# EAGLE design InexpensiveTNC-v4-mod (EAGLE 6.3)
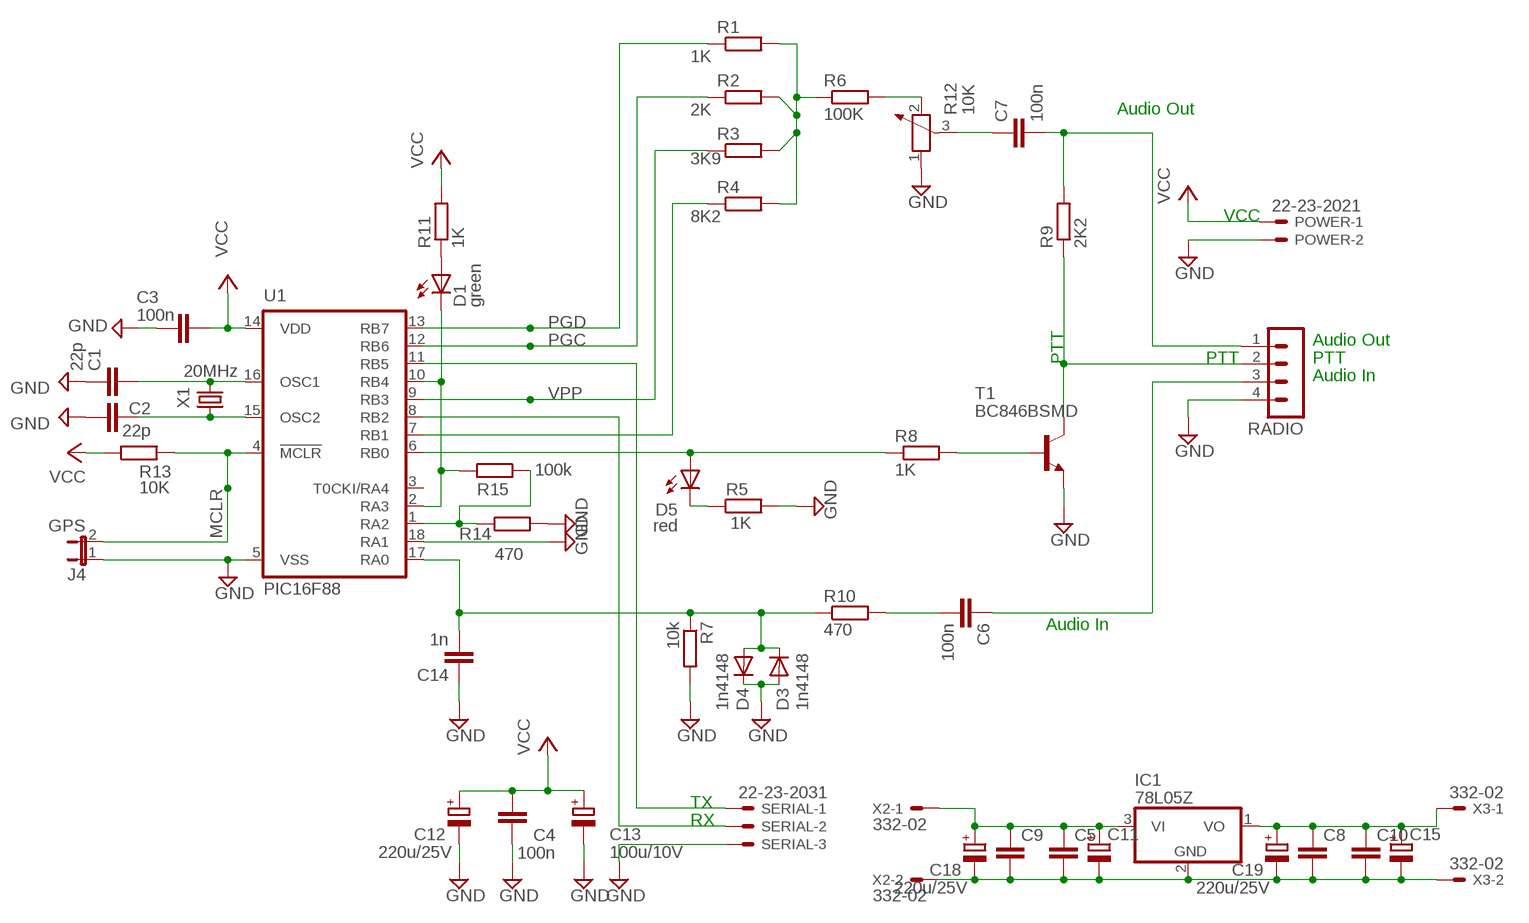
[diagram p0: schematic, sheet 1]

## Parts
C1  22p  C-EUC0805  [C0805]
C2  22p  C-EUC0805  [C0805]
C3  100n  C-EUC0805  [C0805]
C4  100n  C-EUC0805  [C0805]
C5  C-EU025-025X050  [C025-025X050]
C6  100n  C-EUC0805  [C0805]
C7  100n  C-EUC0805  [C0805]
C8  C-EU025-025X050  [C025-025X050]
C9  C-EUC0805K  [C0805K]
C10  C-EUC0805K  [C0805K]
C11  CPOL-EUE3.5-10  [E3,5-10]
C12  220u/25V  CPOL-EUA  [PANASONIC_A]
C13  100u/10V  CPOL-EUA  [PANASONIC_A]
C14  1n  C-EUC0805  [C0805]
C15  CPOL-EUE3.5-10  [E3,5-10]
C18  220u/25V  CPOL-EUA  [PANASONIC_A]
C19  220u/25V  CPOL-EUA  [PANASONIC_A]
D1  green  LEDCHIPLED_1206  [CHIPLED_1206]
D3  1n4148  DIODE-MINIMELF  [MINIMELF]
D4  1n4148  DIODE-MINIMELF  [MINIMELF]
D5  red  LEDCHIPLED_1206  [CHIPLED_1206]
IC1  78L05Z  [TO92]
J4  GPS  JP1E  [JP1]
POWER  22-23-2021  [22-23-2021]
R1  1K  R-EU_R0805W  [R0805W]
R2  2K  R-EU_R0805W  [R0805W]
R3  3K9  R-EU_R0805W  [R0805W]
R4  8K2  R-EU_R0805W  [R0805W]
R5  1K  R-EU_R0805W  [R0805W]
R6  100K  R-EU_R0805W  [R0805W]
R7  10k  R-EU_R0805W  [R0805W]
R8  1K  R-EU_R0805W  [R0805W]
R9  2K2  R-EU_R0805W  [R0805W]
R10  470  R-EU_R0805W  [R0805W]
R11  1K  R-EU_R0805W  [R0805W]
R12  10K  POTENTIOMETER_PT-10S  [PT-10S]
R13  10K  R-EU_R0805W  [R0805W]
R14  470  R-EU_R0805W  [R0805W]
R15  100k  R-EU_R0805W  [R0805W]
RADIO  MA04-1  [MA04-1]
SERIAL  22-23-2031  [22-23-2031]
T1  BC846BSMD  [SOT23]
U1  PIC16F88  PIC16F83SO  [SO-18W]
X1  20MHz  CRYSTALHC49U70  [HC49U70]
X2  332-02  [332-02]
X3  332-02  [332-02]

## Nets
GND: C1.1 C2.1 C3.2 C4.1 C12.- C13.- C14.1 D3.A D4.C J4.1 POWER.2 R5.2 R7.2 R12.1 R14.2 RADIO.4 SERIAL.3 T1.2(E) U1.5(VSS) U1.18(RA1)
MCLR: J4.2 R13.2 U1.4(!MCLR)
N$2: C1.2 U1.16(OSC1) X1.2
N$3: C2.2 U1.15(OSC2) X1.1
N$12: D1.A R11.1
N$16: R4.1 U1.7(RB1)
N$17: D1.C R15.2 U1.2(RA3) U1.10(RB4)
N$18: R8.2 T1.1(B)
N$19: R1.2 R2.2 R3.2 R4.2 R6.1
N$20: R6.2 R12.2
N$21: C7.1 R12.3
N$22: D5.A R8.1 U1.6(RB0)
N$23: D5.C R5.1
N$24: R9.1 RADIO.2 T1.3(C)
N$25: C7.2 R9.2 RADIO.1
N$26: C14.2 D3.C D4.A R7.1 R10.1 U1.17(RA0)
N$27: C6.2 R10.2
N$29: R14.1 R15.1 U1.1(RA2)
N$30: C6.1 RADIO.3
N$31: SERIAL.1 U1.11(RB5)
N$32: SERIAL.2 U1.8(RB2)
PGC: R2.1 U1.12(RB6)
PGD: R1.1 U1.13(RB7)
VCC: C3.1 C4.2 C12.+ C13.+ POWER.1 R11.2 R13.1 U1.14(VDD)
VPP: R3.1 U1.9(RB3)
VREG-GND: C5.2 C8.2 C9.2 C10.2 C11.- C15.- C18.- C19.- IC1.2(GND) X2.2 X3.2
VREG-VIN: C5.1 C9.1 C11.+ C18.+ IC1.3(VI) X2.1
VREG-VOUT: C8.1 C10.1 C15.+ C19.+ IC1.1(VO) X3.1
Unconnected: U1.3(T0CKI/RA4)

## Notes on the sheet
- Audio Out
- VCC
- Audio Out
- PTT | PTT | PTT
- Audio In
- Audio In
- TX
- RX

## Library data of the parts
C1-C10 C14 = rcl:C-EU: CAPACITOR, European symbol
C11-C13 C15 C18 C19 = rcl:CPOL-EU: POLARIZED CAPACITOR, European symbol
D1 D5 = led:LED: LED OSRAM: - CHIPLED LG R971, LG N971, LY N971, LG Q971, LY Q971, LO R971, LY R971 LH N974, LH R974 LS Q976, LO Q976, LY Q976 LO Q996 - Hyper CHIPLED LW Q18S LB Q993, LB Q99A, LB R99A - SideLED LS A670, LO A670, LY A670, LG A670, LP A670 LB A673, LV A673, LT A673, LW A673 LH A674 LY A675 LS A676, LA A676, LO A676, LY A676, LW A676 LS A679, LY A679, LG A679 - Hyper Micro SIDELED® LS Y876, LA Y876, LO Y876, LY Y876 LT Y87S - SmartLED LW L88C, LW L88S LB L89C, LB L89S, LG L890 LS L89K, LO L89K, LY L89K LS L896, LA L896, LO L896, LY L896 - TOPLED LS T670, LO T670, LY T670, LG T670, LP T670 LSG T670, LSP T670, LSY T670, LOP T670, LYG T670 LG T671, LOG T671, LSG T671 LB T673, LV T673, LT T673, LW T673 LH T674 LS T676, LA T676, LO T676, LY T676, LB T676, LH T676, LSB T676, LW T676 LB T67C, LV T67C, LT T67C, LS T67K, LO T67K, LY T67K, LW E67C LS E67B, LA E67B, LO E67B, LY E67B, LB E67C, LV E67C, LT E67C LW T67C LS T679, LY T679, LG T679 LS T770, LO T770, LY T770, LG T770, LP T770 LB T773, LV T773, LT T773, LW T773 LH T774 LS E675, LA E675, LY E675, LS T675 LS T776, LA T776, LO T776, LY T776, LB T776 LHGB T686 LT T68C, LB T68C - Hyper Mini TOPLED® LB M676 - Mini TOPLED Santana® LG M470 LS M47K, LO M47K, LY M47K Source: http://www.osram.convergy.de LUXEON: - LUMILED® LXK2-PW12-R00, LXK2-PW12-S00, LXK2-PW14-U00, LXK2-PW14-V00 LXK2-PM12-R00, LXK2-PM12-S00, LXK2-PM14-U00 LXK2-PE12-Q00, LXK2-PE12-R00, LXK2-PE12-S00, LXK2-PE14-T00, LXK2-PE14-U00 LXK2-PB12-K00, LXK2-PB12-L00, LXK2-PB12-M00, LXK2-PB14-N00, LXK2-PB14-P00, LXK2-PB14-Q00 LXK2-PR12-L00, LXK2-PR12-M00, LXK2-PR14-Q00, LXK2-PR14-R00 LXK2-PD12-Q00, LXK2-PD12-R00, LXK2-PD12-S00 LXK2-PH12-R00, LXK2-PH12-S00 LXK2-PL12-P00, LXK2-PL12-Q00, LXK2-PL12-R00 Source: www.luxeon.com KINGBRIGHT: KA-3528ASYC Source: www.kingbright.com
D3 D4 = diode:DIODE-: DIODE
IC1 = linear:78*: Positive VOLTAGE REGULATOR Source: http://cache.national.com/ds/LM/LM78L05.pdf http://www.fairchildsemi.com/ds/LM/LM7805.pdf
J4 = jumper:JP1E: JUMPER
POWER = con-molex:22-23-2021: .100" (2.54mm) Center Header - 2 Pin; MF: MOLEX; MPN: 22-23-2021; OC_FARNELL: 1462926; OC_NEWARK: 25C3832
R1-R11 R13-R15 = rcl:R-EU_: RESISTOR, European symbol
R12 = rcl:POTENTIOMETER_: Potentiometer
RADIO = con-lstb:MA04-1: PIN HEADER; OC_FARNELL: unknown; OC_NEWARK: unknown
SERIAL = con-molex:22-23-2031: .100" (2.54mm) Center Header - 3 Pin; MF: MOLEX; MPN: 22-23-2031; OC_FARNELL: 1462950; OC_NEWARK: 30C0862
T1 = transistor-npn:BC846*: NPN Transistor
U1 = microchip:PIC16F8*: MICROCONTROLLER 8-Bit PIC16F8X Family - CMOS Flash/EEPROM Pin Compatible : PIC16F83, PIC16CR83, PIC16F84A, PIC16CR84 see also PIC16C* <DEVICE:PIC16C*>; MF: MICROCHIP; MPN: PIC16F83-04/SO; OC_FARNELL: unknown; OC_NEWARK: 23C4997
X1 = crystal:CRYSTAL: CRYSTAL
X2 X3 = con-garry:332-02: 2 Pin - 2mm Dual Row Source: www.mpe-connector.de / garry_shortform_2012.pdf

## Board
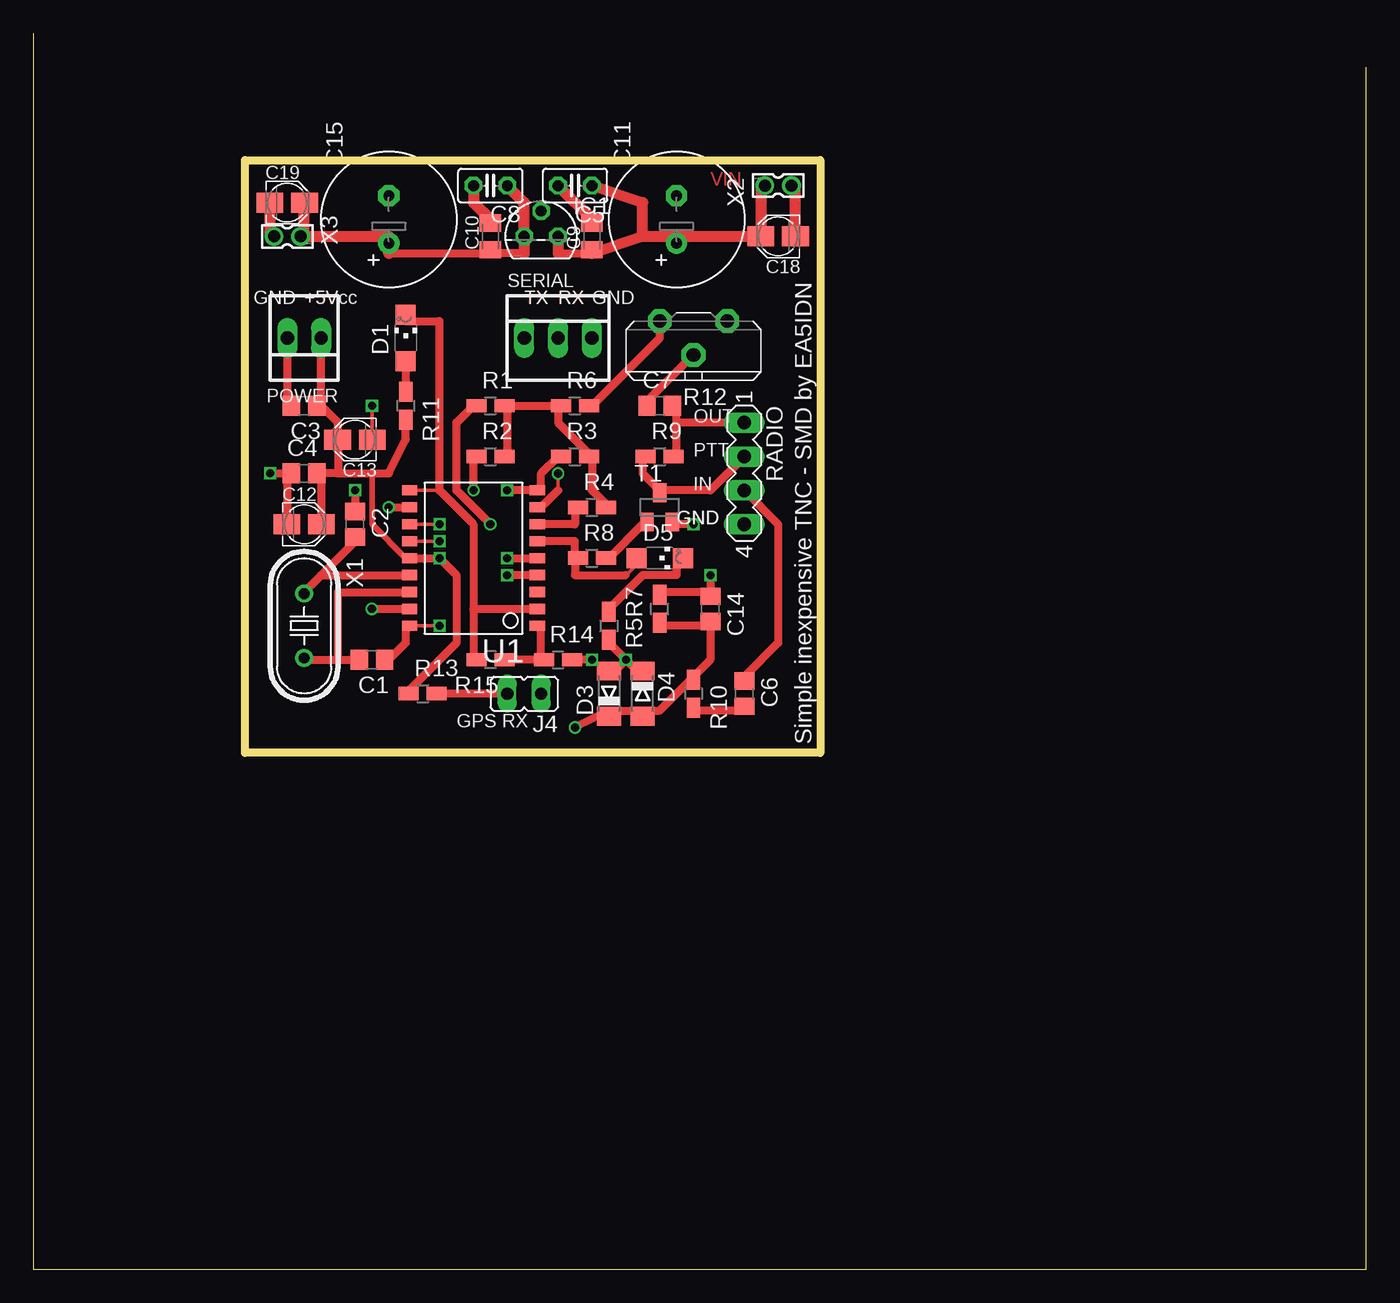
[diagram p1: board, top side]
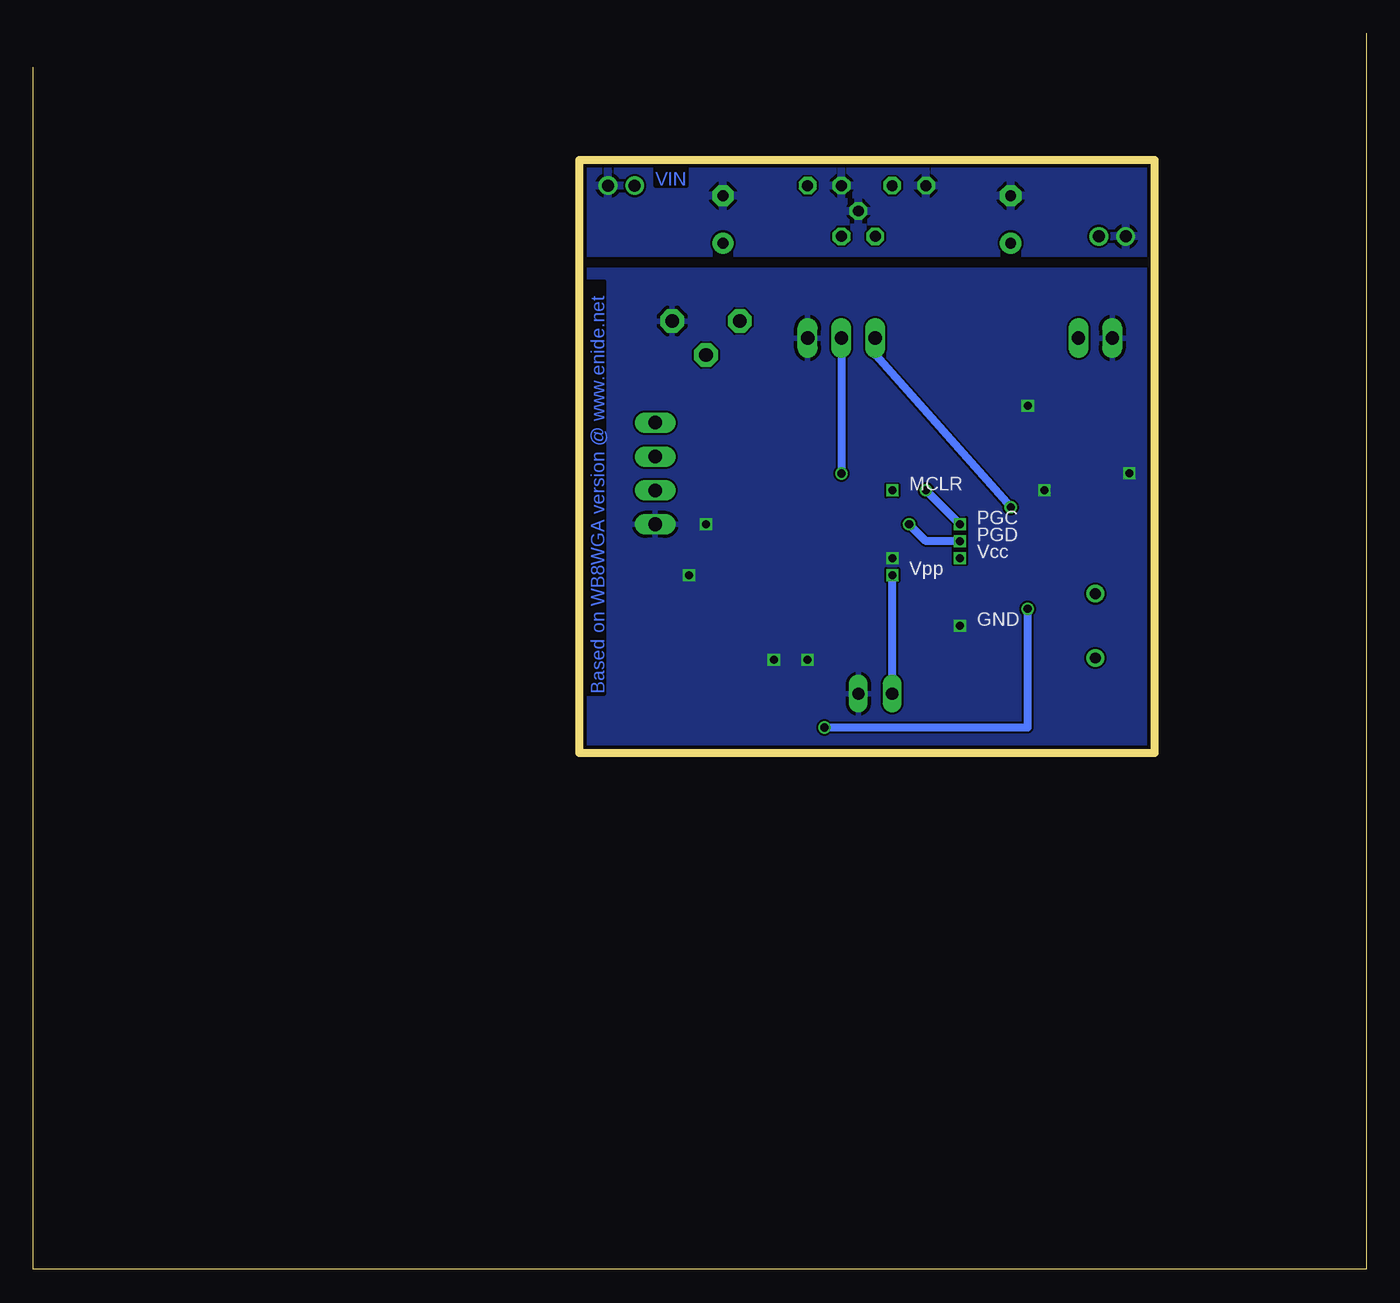
[diagram p2: board, bottom side, seen from below]

Size 100 x 92.7 mm. Coordinates in mm from the lower left corner, seen from the top.
Outline: 100,90.16 100,0 0,0 0,92.7
Outline: 15.88,83.19 59.05,83.19 59.05,38.73 15.88,38.73 15.88,83.19
Copper layers (1*16): Top 0.035mm / dielectric 1.5mm / Bottom 0.035mm
Design rules "ITEADstudio_DRC": minimum track width 6mil, minimum drill 12mil, track to track 6mil, track to pad 6mil, pad to pad 6mil, via to via 6mil, smd to smd 0mil, copper to edge 10mil, drill to drill 10mil, minimum pad ring 10mil, minimum via ring 6mil, stop-mask expansion 2mil, vias tented up to drill 100mil, thermal gap 10mil
tKeepout: 1 lines

### Footprints (pad centres in the part's own frame; a part is rotated, then mirrored left to right if it is on the bottom)
C0805 = smd 1.3 x 1.5: 1 -0.95,0; 2 0.95,0
C025-025X050 = drill 0.813 octagon: 1 -1.27,0; 2 1.27,0
C0805K = smd 1.3 x 1.6: 1 -1,0; 2 1,0
E3,5-10 = drill 0.813 pad 1.6: + -1.778,0 | drill 0.813 pad 1.6 octagon: - 1.778,0
PANASONIC_A = smd 2 x 1.5: + 1.3,0; - -1.3,0
CHIPLED_1206 = smd 1.5 x 1.5: A 0,-1.75; C 0,1.75
MINIMELF = smd 1.4 x 1.8: A 1.7,0; C -1.7,0
TO92 = drill 0.813 octagon: 1 -1.27,0; 2 0,1.905; 3 1.27,0
JP1 = drill 0.914 long: 1 0,-1.27; 2 0,1.27
22-23-2021 = drill 1 long: 1 -1.27,0; 2 1.27,0
R0805W = smd 1.5 x 1: 1 -1.052,0; 2 1.052,0
PT-10S = drill 1.016 pad 1.778 octagon: 1 -2.54,-1.27; 2 2.54,-1.27; 3 0,1.27
MA04-1 = drill 1.016 long: 1 -3.81,0; 2 -1.27,0; 3 1.27,0; 4 3.81,0
22-23-2031 = drill 1 long: 1 -2.54,0; 2 0,0; 3 2.54,0
SOT23 = smd 1 x 1.4: 1 -0.95,-1.1; 2 0.95,-1.1; 3 0,1.1
SO-18W = smd 0.762 x 1.143: 1 -5.08,-4.788; 2 -3.81,-4.788; 3 -2.54,-4.788; 4 -1.27,-4.788; 5 0,-4.788; 6 1.27,-4.788; 7 2.54,-4.788; 8 3.81,-4.788; 9 5.08,-4.788; 10 5.08,4.788; 11 3.81,4.788; 12 2.54,4.788; 13 1.27,4.788; 14 0,4.788; 15 -1.27,4.788; 16 -2.54,4.788; 17 -3.81,4.788; 18 -5.08,4.788
HC49U70 = drill 0.813: 1 -2.413,0; 2 2.413,0
332-02 = drill 0.9 pad 1.27: 1 0,-1; 2 0,1

### Placement (x,y rotation side)
C1  25.4,45.72 180 top
C2  24.13,55.88 270 top
C3  20.32,64.77 180 top
C4  20.32,59.69 0 top
C5  40.64,81.28 180 top
C6  53.34,43.18 270 top
C7  46.99,64.77 0 top
C8  34.29,81.28 180 top
C9  41.91,77.47 90 top
C10  34.29,77.47 90 top
C11  48.26,78.74 90 top
C12  20.32,55.88 0 top
C13  24.13,62.23 180 top
C14  50.8,49.53 270 top
C15  26.67,78.74 90 top
C18  55.88,77.47 180 top
C19  19.05,80.01 0 top
D1  27.94,69.85 0 top
D3  43.18,43.18 90 top
D4  45.72,43.18 270 top
D5  46.99,53.34 270 top
IC1  38.1,77.47 0 top
J4  36.83,43.18 90 top
POWER  20.32,69.85 180 top
R1  34.29,64.77 0 top
R2  34.29,60.96 0 top
R3  40.64,60.96 0 top
R4  41.91,57.15 0 top
R5  43.18,48.26 270 top
R6  40.64,64.77 0 top
R7  46.99,49.53 90 top
R8  41.91,53.34 0 top
R9  46.99,60.96 0 top
R10  49.53,43.18 270 top
R11  27.94,64.77 270 top
R12  49.53,69.85 180 top
R13  29.21,43.18 0 top
R14  39.37,45.72 0 top
R15  34.29,45.72 180 top
RADIO  53.34,59.69 270 top
SERIAL  39.37,69.85 0 top
T1  46.99,57.15 0 top
U1  33.02,53.34 90 top
X1  20.32,48.26 270 top
X2  55.88,81.28 270 top
X3  19.05,77.47 90 top

### Tracks (layer width: path | path; a pad name or v marks a point on that pad's centre or on a via)
GND  (via drill 0.6)
  Top 0.254: v30.48,48.26 U1.18 27.94,48.26 | 38.1,53.34 U1.5 | 48.26,55.88 T1.2 | 26.67,45.72 C1.1 | 43.18,46.99 R5.2 | 46.99,50.8 R7.2 | 50.8,50.8 C14.1 | 19.05,64.77 C3.2 | 43.18,44.45 D3.A | 45.72,44.45 D4.C | 19.05,55.88 C12.- | 19.05,59.69 C4.1 | v25.4,64.77 25.4,62.23 C13.-
  Top 0.61: v35.56,53.34 U1.5 | v49.53,55.88 48.26,55.88 | v24.13,58.42 C2.1 | 26.67,45.72 27.94,46.99 27.94,48.26 | v44.45,45.72 43.18,46.99 | v50.8,52.07 50.8,50.8 46.99,50.8 | v17.78,59.69 19.05,59.69 19.05,55.88 | POWER.2 19.05,64.77 | v44.45,45.72 43.18,44.45 | v44.45,45.72 45.72,44.45 | v41.91,45.72 R14.2
  pour Bottom: 16.51,74.93 58.42,74.93 58.42,39.37 16.51,39.37
MCLR  (via drill 0.6)
  Top 0.254: 38.1,52.07 U1.4
  Top 0.61: U1.4 v35.56,52.07 | J4.2 R13.2
  Bottom 0.61: J4.2 v35.56,52.07
N$2
  Top 0.254: 20.32,45.72 X1.2
  Top 0.61: U1.16 22.86,50.8 22.86,45.72 | 20.32,45.72 22.86,45.72 | 22.86,45.72 C1.2
N$3
  Top 0.254: 20.32,50.8 X1.1 | 24.13,54.61 C2.2
  Top 0.61: 21.59,52.07 U1.15 | 24.13,54.61 21.59,52.07 | 21.59,52.07 20.32,50.8
N$12
  Top 0.254: 27.94,68.58 D1.A
  Top 0.61: D1.A R11.1
N$16
  Top 0.254: 40.64,57.15 R4.1
  Top 0.61: U1.7 40.64,55.88 40.64,57.15
N$17
  Top 0.254: 27.94,71.12 D1.C | 30.48,58.42 U1.10 27.94,58.42 | 38.1,49.53 U1.2 | 33.02,45.72 R15.2
  Top 0.61: 27.94,71.12 30.48,71.12 30.48,58.42 33.02,55.88 33.02,49.53 | 33.02,49.53 U1.2 | 33.02,49.53 33.02,45.72
N$18
  Top 0.254: 45.72,55.88 T1.1 | 43.18,53.34 R8.2
  Top 0.61: 43.18,53.34 45.72,55.88
N$19
  Top 0.254: 43.18,57.15 R4.2 | 35.56,60.96 R2.2 | 35.56,64.77 R1.2 | 41.91,60.96 R3.2 | 39.37,64.77 R6.1
  Top 0.61: 43.18,57.15 41.91,58.42 41.91,60.96 39.37,63.5 39.37,64.77 35.56,64.77 35.56,60.96
N$20
  Top 0.254: 41.91,64.77 R6.2
  Top 0.61: 41.91,64.77 46.99,69.85 R12.2
N$21
  Top 0.254: 45.72,64.77 C7.1
  Top 0.61: R12.3 45.72,64.77
N$22
  Top 0.254: 44.45,52.07 45.72,53.34 D5.A | 40.64,53.34 R8.1
  Top 0.61: U1.6 40.64,54.61 40.64,53.34 40.64,52.07 44.45,52.07
N$23
  Top 0.254: 48.26,53.34 D5.C | 43.18,49.53 R5.1
  Top 0.61: 48.26,53.34 48.26,52.07 45.72,52.07 43.18,49.53
N$24
  Top 0.254: 45.72,60.96 R9.1 | 46.99,58.42 T1.3
  Top 0.61: 45.72,60.96 45.72,59.69 46.99,58.42 50.8,58.42 RADIO.2
N$25
  Top 0.254: 48.26,64.77 C7.2 | 48.26,60.96 R9.2
  Top 0.61: 48.26,60.96 48.26,63.5 | 48.26,63.5 48.26,64.77 | RADIO.1 48.26,63.5
N$26  (via drill 0.61)
  Top 0.254: 46.99,48.26 R7.1 | 50.8,48.26 C14.2 | 43.18,41.91 D3.C | 49.53,44.45 R10.1 | 45.72,41.91 D4.A
  Top 0.61: 46.99,48.26 50.8,48.26 50.8,45.72 49.53,44.45 46.99,41.91 45.72,41.91 43.18,41.91 v40.64,40.64 | v25.4,49.53 U1.17
  Bottom 0.61: v25.4,49.53 25.4,40.64 v40.64,40.64
N$27
  Top 0.254: 49.53,41.91 R10.2 | 53.34,41.91 C6.2
  Top 0.61: 53.34,41.91 49.53,41.91
N$29
  Top 0.254: 38.1,48.26 U1.1 | 38.1,45.72 R14.1 | 35.56,45.72 R15.1
  Top 0.61: 38.1,48.26 38.1,45.72 35.56,45.72
N$30
  Top 0.254: 53.34,44.45 C6.1
  Top 0.61: 53.34,44.45 55.88,46.99 55.88,55.88 RADIO.3
N$31  (via drill 0.61)
  Top 0.61: v26.67,57.15 U1.11
  Bottom 0.61: v26.67,57.15 36.83,68.58 SERIAL.1
N$32  (via drill 0.61)
  Top 0.254: v39.37,59.69 39.37,58.42 | 38.1,57.15 U1.8
  Top 0.61: 39.37,58.42 38.1,57.15
  Bottom 0.61: SERIAL.2 v39.37,59.69
PGC  (via drill 0.6, 0.61)
  Top 0.254: v30.48,55.88 U1.12 27.94,55.88 | 33.02,60.96 R2.1
  Top 0.61: v33.02,58.42 33.02,60.96
  Bottom 0.61: v30.48,55.88 v33.02,58.42
PGD  (via drill 0.6, 0.61)
  Top 0.254: v30.48,54.61 U1.13 27.94,54.61 | 33.02,64.77 R1.1
  Top 0.61: 33.02,64.77 31.75,63.5 31.75,58.42 v34.29,55.88
  Bottom 0.61: v34.29,55.88 33.02,54.61 v30.48,54.61
VCC  (via drill 0.6)
  Top 0.254: 27.94,43.18 R13.1 | 22.86,62.23 C13.+ | 21.59,55.88 C12.+ | 21.59,59.69 C4.2 | 21.59,64.77 C3.1 | 27.94,53.34 U1.14
  Top 0.406: 27.94,53.34 25.4,55.88 25.4,59.69
  Top 0.61: U1.14 v30.48,53.34 31.75,52.07 31.75,46.99 27.94,43.18 | 22.86,59.69 21.59,59.69 21.59,55.88 | 22.86,59.69 22.86,62.23 22.86,63.5 21.59,64.77 POWER.1 | R11.2 27.94,62.23 26.67,59.69 25.4,59.69 22.86,59.69
VPP  (via drill 0.6)
  Top 0.254: 39.37,60.96 R3.1 | 38.1,58.42 U1.9
  Top 0.61: U1.9 v35.56,58.42 | 39.37,60.96 38.1,59.69 38.1,58.42
VREG-GND
  Top 0.152: 41.91,78.74 C9.2 | 17.78,80.01 C19.- | 17.78,77.47 X3.2 | 57.15,77.47 C18.- | 57.15,81.28 X2.2 | 34.29,78.74 C10.2
  Top 0.813: C5.2 41.91,78.74 | 17.78,77.47 17.78,80.01 | 57.15,81.28 57.15,77.47 | 34.29,78.74 33.02,80.01 C8.2
  pour Bottom: 16.51,76.2 58.42,76.2 58.42,82.55 16.51,82.55
VREG-VIN
  Top 0.152: 54.61,81.28 X2.1 | 41.91,76.2 C9.1 | 54.61,77.47 C18.+ | 48.26,77.47 C11.+
  Top 0.61: 39.37,76.2 41.91,76.2
  Top 0.813: 54.61,81.28 54.61,77.47 | IC1.3 39.37,76.2 | C5.1 45.72,80.01 45.72,77.47 | 41.91,76.2 45.72,77.47 | 45.72,77.47 48.26,77.47 C18.+
VREG-VOUT
  Top 0.152: 20.32,80.01 C19.+ | 26.67,77.47 C15.+ | 20.32,77.47 X3.1 | 34.29,76.2 C10.1
  Top 0.61: 36.83,76.2 34.29,76.2 26.67,76.2
  Top 0.813: 36.83,76.2 IC1.1 36.83,80.01 C8.1 | 20.32,80.01 20.32,77.47 26.67,77.47 | 26.67,76.2 C15.+

### Text on the board
Top: VIN | +5V | TX | RX
Bottom: VIN | Based on WB8WGA version @ www.enide.net
tNames: GND | +5Vcc | TX | RX | GND | OUT | PTT | IN | GND | GND | GPS RX | Simple inexpensive TNC - SMD by EA5IDN
bNames: MCLR | PGC | PGD | Vcc | Vpp | GND